# Altium schematic sheet mechanical_marking.SchDoc
size A4; SheetNumber: 20; SheetTotal: 21
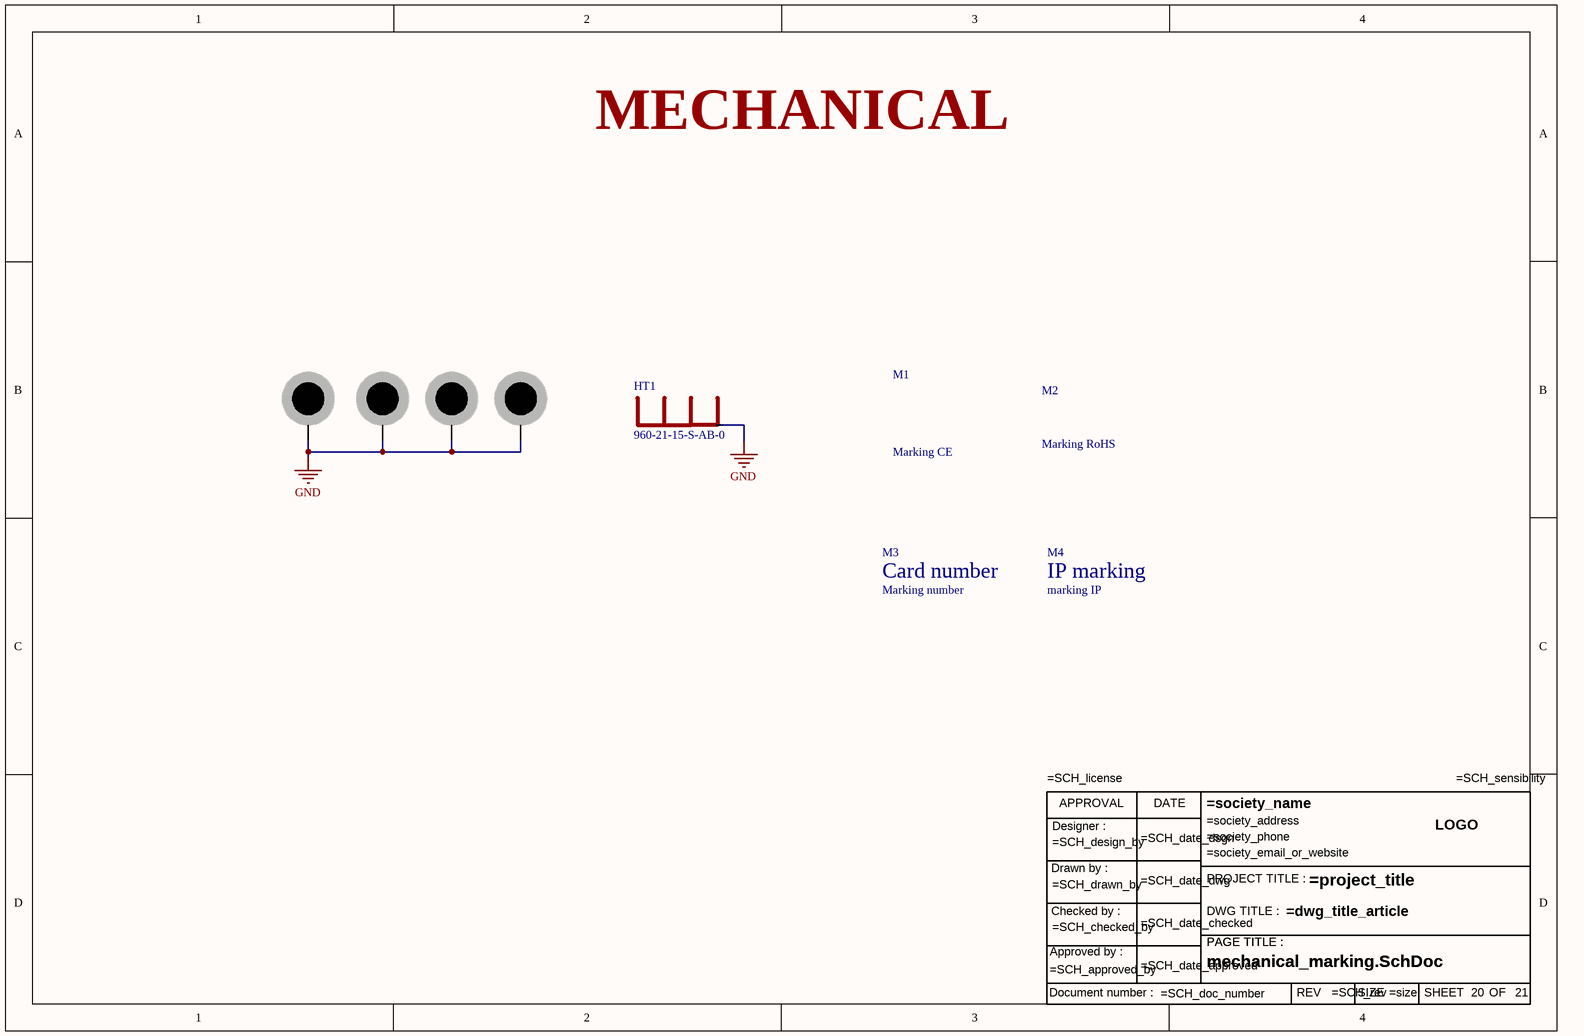
[diagram p0: mechanical_marking.SchDoc]

## Parts
HT1  960-21-15-S-AB-0  [Heatsink BGA 21x21mm]
M1  Marking CE  [MARKING CE]
M2  Marking RoHS  [MARKING ROHS]
M3  Marking number  [MARKING number]
M4  marking IP  [MARKING IP]
MT1  Mounting hole  [mountinghole]  (value not drawn)
MT2  Mounting hole  [mountinghole]  (value not drawn)
MT3  Mounting hole  [mountinghole]  (value not drawn)
MT4  Mounting hole  [mountinghole]  (value not drawn)
TB19  Title bloc ANSI modified  (value not drawn)

## Nets
GND: HT1.1 MT1.0 MT2.0 MT3.0 MT4.0

## Notes on the sheet
- MECHANICAL
- (in symbol marking IP) IP marking
- (in symbol Title bloc ANSI) APPROVAL; DATE; Designer :; LOGO; Drawn by :; PROJECT TITLE :; Checked by :; DWG TITLE :; PAGE TITLE :; Approved by :; Document number :; REV; SIZE; SHEET; OF

## Library data of the parts
HT1 = Heatsink BGA 21x21mm: / Heatsink : 960-21-15-S-AB-0 / 6°/W @ 200LFM
M1 = Marking CE: CE marking
M2 = Marking RoHS: RoHS marking
M3 = Marking number: Card number
M4 = marking IP: for IP marking
MT1-MT4 = Mounting hole: mounting hole / H : 3.2mm / D : 5.2mm
TB19 = Title bloc ANSI